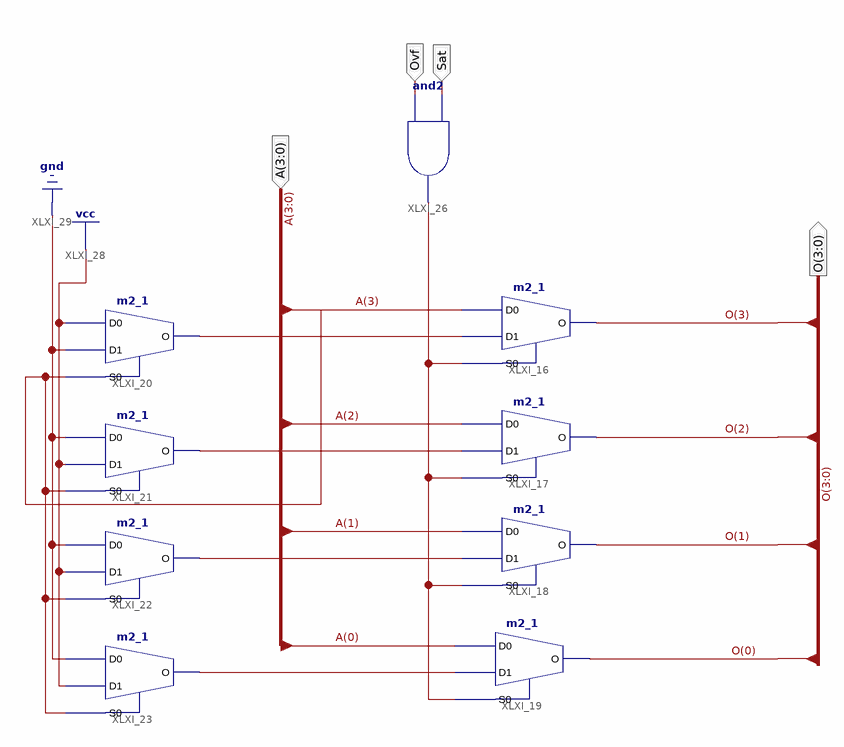
[diagram p0: schematic sheet 1]
// Xilinx ISE schematic saturador.sch (spartan3) as structural Verilog: 9 symbols, 4 ports
module saturador (
  input  [3:0] A,
  input  Ovf,
  input  Sat,
  output [3:0] O
);

  wire S, XLXN_45, XLXN_46, XLXN_47, XLXN_48;

  m2_1 XLXI_16 (.D0(A[3]), .D1(XLXN_45), .S0(S), .O(O[3]));
  m2_1 XLXI_17 (.D0(A[2]), .D1(XLXN_46), .S0(S), .O(O[2]));
  m2_1 XLXI_18 (.D0(A[1]), .D1(XLXN_47), .S0(S), .O(O[1]));
  m2_1 XLXI_19 (.D0(A[0]), .D1(XLXN_48), .S0(S), .O(O[0]));
  m2_1 XLXI_20 (.D0(1'b1), .D1(1'b0), .S0(A[3]), .O(XLXN_45));
  m2_1 XLXI_21 (.D0(1'b0), .D1(1'b1), .S0(A[3]), .O(XLXN_46));
  m2_1 XLXI_22 (.D0(1'b0), .D1(1'b1), .S0(A[3]), .O(XLXN_47));
  m2_1 XLXI_23 (.D0(1'b0), .D1(1'b1), .S0(A[3]), .O(XLXN_48));
  and XLXI_26 (S, Ovf, Sat);
endmodule
